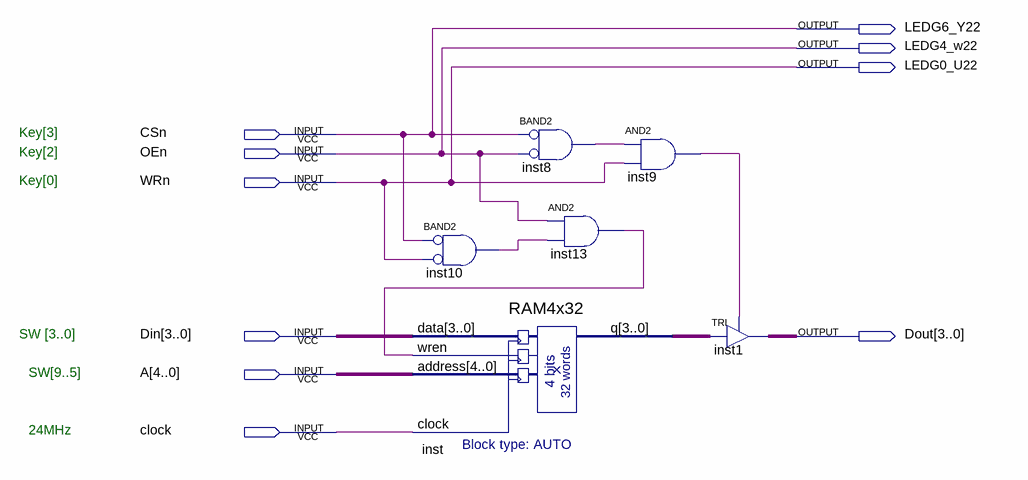
[diagram p0: schematic sheet]
// Quartus schematic Ram.bdf as structural Verilog: 6 symbols, 10 pins
module Ram (
  input  CSn,
  input  OEn,
  input  WRn,
  input  [3:0] Din,
  input  [4:0] A,
  input  clock,
  output LEDG6_Y22,
  output LEDG4_w22,
  output LEDG0_U22,
  output [3:0] Dout
);

  wire inst8_out, inst9_out, inst10_out, inst13_out;
  wire [3:0] inst_q;

  and inst10 (inst10_out, ~CSn, ~WRn);  // BAND2
  RAM4x32 inst (.data(Din), .wren(inst13_out), .address(A), .clock(clock), .q(inst_q));
  and inst8 (inst8_out, ~CSn, ~OEn);  // BAND2
  and inst13 (inst13_out, OEn, inst10_out);
  and inst9 (inst9_out, inst8_out, WRn);
  TRI inst1[3:0] (.IN(inst_q), .OE(inst9_out), .OUT(Dout));

  assign LEDG0_U22 = WRn;
  assign LEDG4_w22 = OEn;
  assign LEDG6_Y22 = CSn;

  // Notes on the sheet:
  //   Key[3]
  //   Key[2]
  //   Key[0]
  //   SW [3..0]
  //   SW[9..5]
  //   24MHz
endmodule
